# Altium project IF_scan.PrjPcb
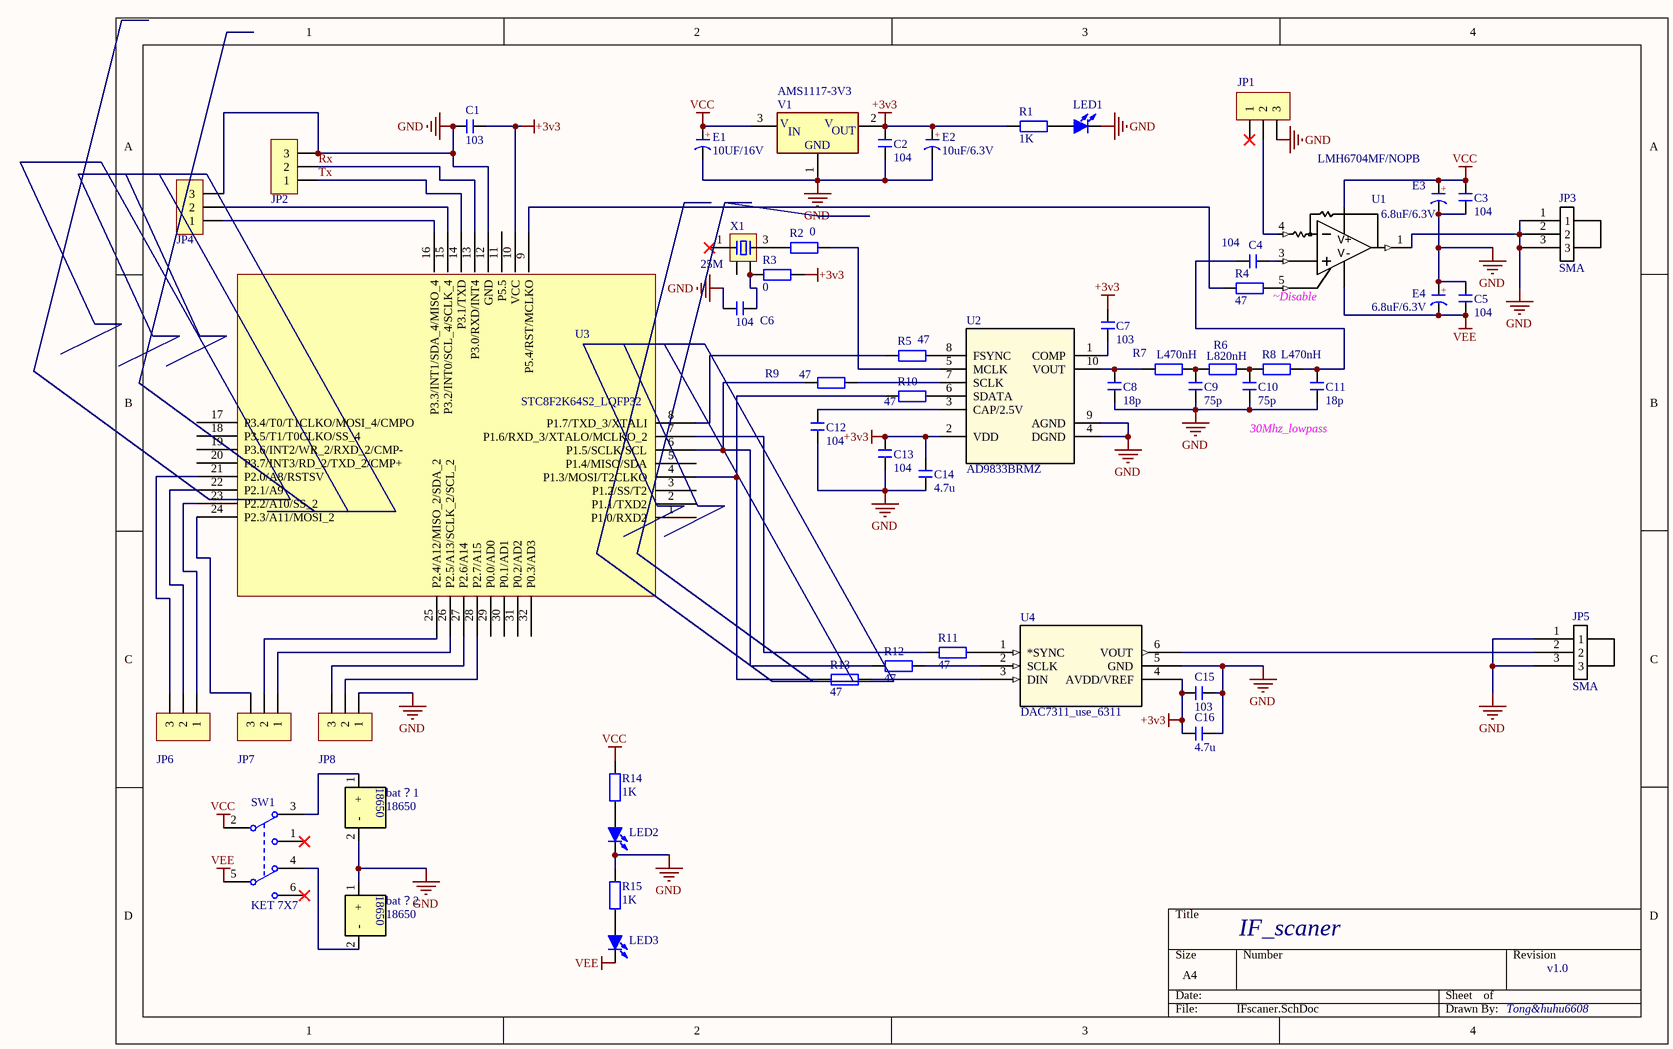
[diagram p0: IFscaner.SchDoc]
1 sheet, 55 parts. Net scope: global (net labels, ports and power ports of the same name join across sheets).

## Sheet IFscaner.SchDoc
size A4

### Parts
bat？1  18650  [18650base]
bat？2  18650  [18650base]
C1  103  [C 0603]
C2  104  [C 0603]
C3  104  [C 0603]
C4  104  [C 0603]
C5  104  [C 0603]
C6  104  [C 0603]
C7  103  [C 0603]
C8  18p  [C 0603]
C9  75p  [C 0603]
C10  75p  [C 0603]
C11  18p  [C 0603]
C12  104  [C 0603]
C13  104  [C 0603]
C14  4.7u  [C 0603]
C15  103  [C 0603]
C16  4.7u  [C 0603]
E1  10UF/16V  [CAP 5.0*10*20]
E2  10uF/6.3V  [CD B(3528)]
E3  6.8uF/6.3V  [CD B(3528)]
E4  6.8uF/6.3V  [CD B(3528)]
JP1  HDR-1X3  [HDR-1X3]  (value not drawn)
JP2  HDR-1X3  [HDR-1X3]  (value not drawn)
JP3  SMA  [SMA_khd]
JP4  HDR-1X3  [HDR-1X3]  (value not drawn)
JP5  SMA  [SMA_khd]
JP6  HDR-1X3  [HDR-1X3]  (value not drawn)
JP7  HDR-1X3  [HDR-1X3]  (value not drawn)
JP8  HDR-1X3  [HDR-1X3]  (value not drawn)
LED1  (no value)  [LED 0603B]
LED2  (no value)  [LED 0603B]
LED3  (no value)  [LED 0603B]
R1  1K  [R 0603]
R2  0  [R 0603]
R3  0  [R 0603]
R4  47  [R 0603]
R5  47  [R 0603]
R6  L820nH  [R 0603]
R7  L470nH  [R 0603]
R8  L470nH  [R 0603]
R9  47  [R 0603]
R10  47  [R 0603]
R11  47  [R 0603]
R12  47  [R 0603]
R13  47  [R 0603]
R14  1K  [R 0603]
R15  1K  [R 0603]
SW1  KET 7X7  [KFT DIP-7X7]
U1  LMH6704MF/NOPB  [SOT23-6L]
U2  AD9833BRMZ  [RM_10]
U3  STC8F2K64S2_LQFP32  [LQFP32]
U4  DAC7311_use_6311  [DCK6]
V1  AMS1117-3V3  [SOT223]
X1  25M  [XTAL-3225]

### Nets
+3v3: C1.2 C2.2 C7.2 C13.1 C14.1 C15.2 C16.2 E2.1(A) R1.2 R3.2 U2.2(VDD) U3.10(VCC) U4.4(AVDD/VREF) V1.2(VOUT)
GND: bat？1.2(-) bat？2.1(+) C1.1 C2.1 C3.1 C5.2 C6.1 C8.2 C9.2 C10.2 C11.2 C12.2 C13.2 C14.2 C15.1 C16.1 E1.2(K) E2.2(K) E3.2(K) E4.1(A) JP1.3 JP2.3 JP3.1 JP3.2 JP3.3 JP4.3 JP5.1 JP5.3 JP8.1 LED1.2(K) LED2.2(K) R15.2 U1.1(A_OUT) U2.4(DGND) U2.9(AGND) U3.12(GND) U4.5(GND) V1.1(GND)
VCC: C3.2 E1.1(A) E3.1(A) R14.2 SW1.2(COM2) V1.3(VIN)
VEE: C5.1 E4.2(K) LED3.2(K) SW1.5(COM2)
Rx: JP2.2 U3.13(P3.0/RXD/INT4)
Tx: JP2.1 U3.14(P3.1/TXD)
Netbat？1_1: bat？1.1(+) SW1.3(NO1)
Netbat？2_2: bat？2.2(-) SW1.4(NO2)
NetC4_1: C4.1 C11.1 R8.2
NetC4_2: C4.2 U1.3(IN+)
NetC6_2: C6.2 R3.1 X1.4
NetC7_1: C7.1 U2.1(COMP)
NetC8_1: C8.1 R7.1 U2.10(VOUT)
NetC9_1: C9.1 R6.1 R7.2
NetC10_1: C10.1 R6.2 R8.1
NetC12_1: C12.1 U2.3(CAP/2.5V)
NetJP1_2: JP1.2 U1.4(IN-)
NetJP4_1: JP4.1 U3.16(P3.3/INT1/SDA_4/MISO_4)
NetJP4_2: JP4.2 U3.15(P3.2/INT0/SCL_4/SCLK_4)
NetJP5_2: JP5.2 U4.6(VOUT)
NetJP6_1: JP6.1 U3.23(P2.2/A10/SS_2)
NetJP6_2: JP6.2 U3.22(P2.1/A9)
NetJP6_3: JP6.3 U3.21(P2.0/A8/RSTSV)
NetJP7_1: JP7.1 U3.26(P2.5/A13/SCLK_2/SCL_2)
NetJP7_2: JP7.2 U3.25(P2.4/A12/MISO_2/SDA_2)
NetJP7_3: JP7.3 U3.24(P2.3/A11/MOSI_2)
NetJP8_2: JP8.2 U3.28(P2.7/A15)
NetJP8_3: JP8.3 U3.27(P2.6/A14)
NetLED1_1: LED1.1(A) R1.1
NetLED2_1: LED2.1(A) R14.1
NetLED3_1: LED3.1(A) R15.1
NetR2_1: R2.1 X1.3
NetR2_2: R2.2 U2.5(MCLK)
NetR4_1: R4.1 U3.9(P5.4/RST/MCLKO)
NetR4_2: R4.2 U1.5(DIS)
NetR5_1: R5.1 U3.8(P1.7/TXD_3/XTALI)
NetR5_2: R5.2 U2.8(FSYNC)
NetR9_1: R9.1 R12.1 U3.6(P1.5/SCLK/SCL)
NetR9_2: R9.2 U2.7(SCLK)
NetR10_1: R10.1 R13.1 U3.4(P1.3/MOSI/T2CLKO)
NetR10_2: R10.2 U2.6(SDATA)
NetR11_1: R11.1 U3.7(P1.6/RXD_3/XTALO/MCLKO_2)
NetR11_2: R11.2 U4.1(*SYNC)
NetR12_2: R12.2 U4.2(SCLK)
NetR13_2: R13.2 U4.3(DIN)

Not connected (* = marked no-connect by the designer): JP1 1*; SW1 1(NC1)* 6(NC2)*; U3 1(P1.0/RXD2) 2(P1.1/TXD2) 3(P1.2/SS/T2) 5(P1.4/MISO/SDA) 11(P5.5) 17(P3.4/T0/T1CLKO/MOSI_4/CMPO) 18(P3.5/T1/T0CLKO/SS_4) 19(P3.6/INT2/WR_2/RXD_2/CMP-) 20(P3.7/INT3/RD_2/TXD_2/CMP+) 29(P0.0/AD0) 30(P0.1/AD1) 31(P0.2/AD2) 32(P0.3/AD3); X1 1* 2

### Notes on the sheet
- (near U1) ~Disable
- 30Mhz_lowpass
- IF_scaner
- v1.0
- Tong&huhu6608
- (in symbol AMS1117) V; IN; OUT
- (in symbol C-CAP) +
- (in symbol C-CD) +
- (in symbol LMH6704MF/NOPB) V+; V-

### Library data of the parts
C1-C16 = C: 无极性贴片电容; 版权归属: 源创客; BOM名称: 无极性贴片电容; 学习资源: www.ooocke.com
E1 = C-CAP: 直插电解电容; 版权归属: 源创客; BOM名称: 直插电解电容; 学习资源: www.ooocke.com
E2-E4 = C-CD: 贴片钽电容; 版权归属: 源创客; BOM名称: 贴片钽电容; 学习资源: www.ooocke.com
JP1 JP2 JP4 JP6-JP8 = Header 3: 3P接插件; 版权归属: 源创客; BOM名称: 3P接插件; 学习资源: www.ooocke.com
LED1-LED3 = LED-SMD: 贴片LED
R1-R15 = R: 贴片电阻; 版权归属: 源创客; BOM名称: 贴片电阻; 学习资源: www.ooocke.com
SW1 = KET 7X7: 7*7自锁开关; 版权归属: 源创客; BOM名称: 7*7自锁开关; 学习资源: www.ooocke.com
U1 = LMH6704MF/NOPB: Manufacturer: NationalSemiconductor; Characteristics: LMH6704MF650MHzProgrammableGainBufferwithShutdown; CompType: BufferIC; TaMin_C: -400; TaMax_C: 850; ComponentLink1DescBC: LMH6704Datasheet; ComponentLink2DescA4: LMH6704WebPage; ComponentLink3DescAC: MF06APackageWebPage; Copyright: Copyright (C) 2018 Accelerated Designs. All rights reserved; Value: LMH6704MF; SymbolVersion: 2008-07-09; PartNumber: LMH6704MF; PackageDescription: 6LeadSOT-23; PackageReference: MF06A_L; RoHS: O; ComponentLink1URL: http//wwwnationalcom/ds/LM/LMH6704pdf; ComponentLink2URL: http//wwwnationalcom/pf/LM/LMH6704html; ComponentLink3URL: http//wwwnationalcom/packaging/folders/mf06ahtml; Version: B1608; LatestRevisionDate: 2009-03-16; LatestRevisionNote: MassUpdate; Publisher: NationalSemiconductor; Published: 2009-03-16
U2 = AD9833BRMZ: Imported; Manufacturer_Part_Number: AD9833BRMZ; Vendor: Vendor; Value: Value; Type: Type; RefDes: Refdes
U3 = STC8F2K32S2_LQFP32
U4 = DAC7311_DCK_6: Imported; Manufacturer: Texas Instruments; INDUSTRY_STD_PKG_TYPE: SC70; FAMILY_NAME: PRECISION DAC (=<10MSPS); PIN_COUNT: 6; PACKAGE_DESIGNATOR: DCK; Datasheet_URL: http://www.ti.com/lit/gpn/DAC7311; GENERIC_PART_NUMBER: DAC7311; Vendor: Texas Instruments; Manufacturer_Part_Number: dac7311_dck_6; Value: Value; Type: Type; RefDes: RefDes
V1 = AMS1117: 三端稳压芯片
X1 = XTAL-4: 4脚晶振